# Altium project amplifier60w.PrjPcb
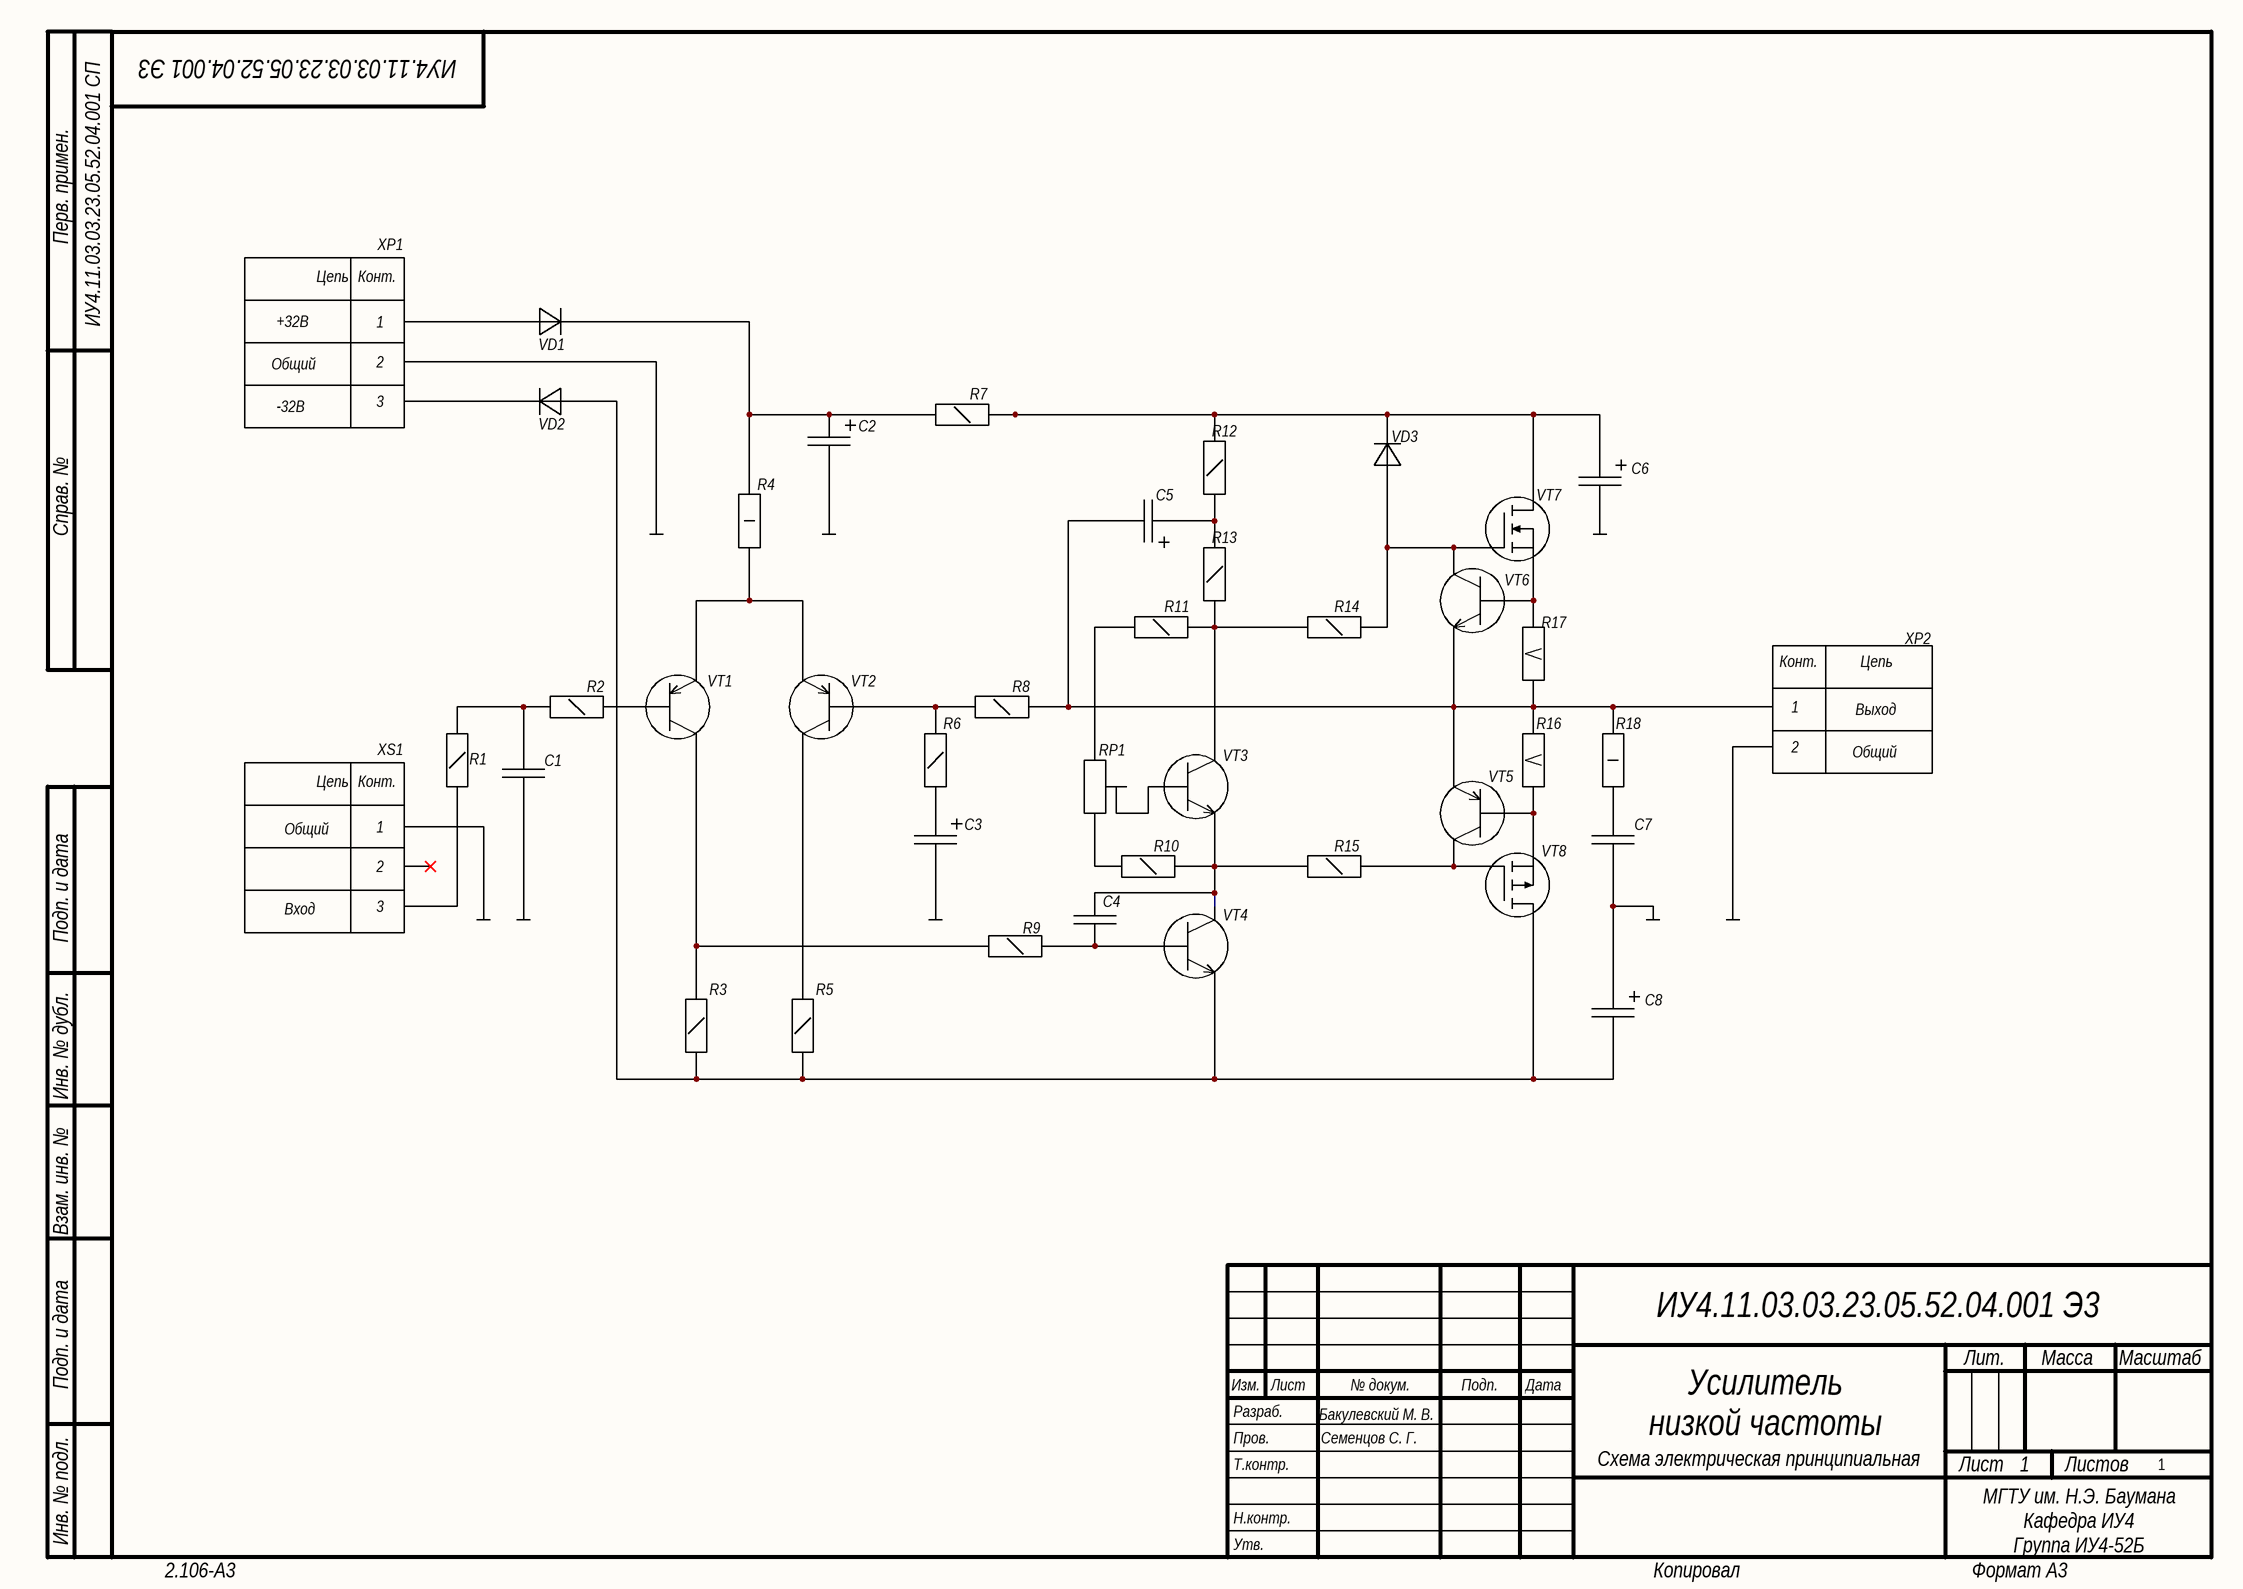
[diagram p0: Sheet1.SchDoc]
1 sheet, 41 parts. Net scope: global (net labels, ports and power ports of the same name join across sheets).
Board file: PCB1.PcbDoc

## Sheet Sheet1.SchDoc
size 420 x 297 mm; CheckedBy: Семенцов С. Г.; DocumentNumber: ИУ4.11.03.03.23.05.52.04.001 Э3; SheetNumber: 1; SheetTotal: 1; DocumentType: Схема электрическая принципиальная; FirstReferrence: ИУ4.11.03.03.23.05.52.04.001 СП

### Parts
C1  Cap Ceramic 100pF  [CAPRR508-350X500X500]  (value not drawn)
C2  2200uF 35V  [CAPPR350-800X700]  (value not drawn)
C3  100uF 100V  [CAPPR500-1000X2050]  (value not drawn)
C4  Cap Ceramic 100pF  [CAPRR508-350X500X500]  (value not drawn)
C5  2200uF 35V  [CAPPR350-800X700]  (value not drawn)
C6  2200uF 35V  [CAPPR750-1600X3150]  (value not drawn)
C7  2200uF 35V  [CAPR1000-400X1300X950]  (value not drawn)
C8  2200uF 35V  [CAPPR750-1600X3150]  (value not drawn)
R1  Resistor 0.25W  [RES1016-630X250]  (value not drawn)
R2  Resistor 0.25W  [RES1016-630X250]  (value not drawn)
R3  Resistor 0.25W  [RES1016-630X250]  (value not drawn)
R4  Resistor 1W  [RES1651-1000X390]  (value not drawn)
R5  Resistor 0.25W  [RES1016-630X250]  (value not drawn)
R6  Resistor 0.25W  [RES1016-630X250]  (value not drawn)
R7  Resistor 0.25W  [RES1016-630X250]  (value not drawn)
R8  Resistor 0.25W  [RES1016-630X250]  (value not drawn)
R9  Resistor 0.25W  [RES1016-630X250]  (value not drawn)
R10  Resistor 0.25W  [RES1016-630X250]  (value not drawn)
R11  Resistor 0.25W  [RES1016-630X250]  (value not drawn)
R12  Resistor 0.25W  [RES1016-630X250]  (value not drawn)
R13  Resistor 0.25W  [RES1016-630X250]  (value not drawn)
R14  Resistor 0.25W  [RES1016-630X250]  (value not drawn)
R15  Resistor 0.25W  [RES1016-630X250]  (value not drawn)
R16  Resistor 5W  [RES_5W]  (value not drawn)
R17  Resistor 5W  [RES_5W]  (value not drawn)
R18  Resistor 1W  [RES1651-1000X390]  (value not drawn)
RP1  (no value)  [TRIM_BOURNS_3296W]
VD1  Diode 15SQ045  [R6]  (value not drawn)
VD2  Diode 15SQ045  [R6]  (value not drawn)
VD3  Diode 1N4002  [DO-41]  (value not drawn)
VT1  BC556B  [TO-92-A]  (value not drawn)
VT2  BC556B  [TO-92-A]  (value not drawn)
VT3  Transistor NPN BC546C  [TO-92-A]  (value not drawn)
VT4  Transistor NPN BC546C  [TO-92-A]  (value not drawn)
VT5  BC556B  [TO-92-A]  (value not drawn)
VT6  BC546C  [TO-92-A]  (value not drawn)
VT7  (no value)  [TO-220AB]
VT8  IRF9510PBF  [TO-220AB]  (value not drawn)
XP1  Общий  [15EDGRC-3.81-03P]  (value not drawn)
XP2  Connector Dynamic 2 pin  [15EDGRC-3.81-02P]  (value not drawn)
XS1  Общий  [ST-025]  (value not drawn)

### Nets
GND: C1.2 C2.2 C3.2 C6.2 C7.2 C8.1 XP1.2 XP2.2 XS1.1
NetC1_1: C1.1 R1.1 R2.1
NetC2_1: C2.1 R4.1 R7.1 VD1.2(К)
NetC3_1: C3.1 R6.2
NetC4_1: C4.1 R9.1 VT4.2(Б)
NetC4_2: C4.2 R10.1 R15.1 VT3.3(Э) VT4.1(К)
NetC5_1: C5.1 R12.1 R13.2
NetC5_2: C5.2 R8.2 R16.2 R17.1 R18.2 VT5.3(Э) VT6.3(Э) XP2.1
NetC6_1: C6.1 R7.2 R12.2 VD3.2(К) VT7.2(D)
NetC7_1: C7.1 R18.1
NetC8_2: C8.2 R3.1 R5.1 VD2.1(А) VT4.3(Э) VT8.2(D)
NetR1_2: R1.2 XS1.3
NetR2_2: R2.2 VT1.2(Б)
NetR3_2: R3.2 R9.2 VT1.1(К)
NetR4_2: R4.2 VT1.3(Э) VT2.3(Э)
NetR5_2: R5.2 VT2.1(К)
NetR6_1: R6.1 R8.1 VT2.2(Б)
NetR10_2: R10.2 RP1.3
NetR11_1: R11.1 RP1.1
NetR11_2: R11.2 R13.1 R14.1 VT3.1(К)
NetR14_2: R14.2 VD3.1(А) VT6.1(К) VT7.1(G)
NetR15_2: R15.2 VT5.1(К) VT8.1(G)
NetR16_1: R16.1 VT5.2(Б) VT8.3(S)
NetR17_2: R17.2 VT6.2(Б) VT7.3(S)
NetRP1_2: RP1.2 VT3.2(Б)
NetVD1_1: VD1.1(А) XP1.1
NetVD2_2: VD2.2(К) XP1.3

Not connected (* = marked no-connect by the designer): XS1 2*

### Notes on the sheet
- +32В
- Общий
- -32В
- Выход
- Вход
- Бакулевский М. В.
- Усилитель
  низкой частоты
- МГТУ им. Н.Э. Баумана
  Кафедра ИУ4
  Группа ИУ4-52Б
- Перв. примен.
- Справ. №
- Подп. и дата
- Инв. № дубл.
- Взам. инв. №
- Разраб.
- Изм.
- Лист
- № докум.
- Подп.
- Дата
- Лит.
- Масса
- Масштаб
- Пров.
- Т.контр.
- Листов
- Инв. № подл.
- Утв.
- Н.контр.
- 2.106-A3
- Копировал
- Формат А3
- (in symbol Connector Audio 3 pin) Цепь; Конт.

### Library data of the parts
C1 C4 = Cap Ceramic 100pF: Type: Конденсатор
C2 C5 = Cap Polarity 47uF 50V: Type: Конденсатор
C3 = Cap Polarity 100uF 100V: Type: Конденсатор
C6 C8 = Cap Polarity 2200uF 35V: Type: Конденсатор
C7 = Cap Film 0.68uF 250V: Type: Конденсатор
RP1 = Resistor Trimmer 1K: Manufacturer: Bourns; PartNumber: 3296W-1-103LF; TypeResistor: Resistor film; Power: 0.5W; Package: 3296W; HelpURL: https://www.digikey.com/product-detail/en/bourns-inc/3296W-1-103LF/3296W-103LF-ND/1088045; ValueManufacturerPartNumber: =TypeResistor+', '+Value+', '+Tolerance+', '+Package+', '+Power+', '+Temperature; Temperature: -55...+125°C
VD1 VD2 = Diode 15SQ045: Type: Диод; Published: 18.05.2010; Publisher: Andrew Danich
VD3 = Diode 1N4002: Type: Диод; Published: 18.05.2010; Publisher: Andrew Danich
VT7 = IRF510PBF
XP1 = Connector Power 3 pin
XS1 = Connector Audio 3 pin
R1-R3 R5-R15 = Resistor 0.25W: Type: Резистор
R4 R18 = Resistor 1W: Type: Резистор
R16 R17 = Resistor 5W: Type: Резистор